# Altium schematic sheet dac.SchDoc
size A4
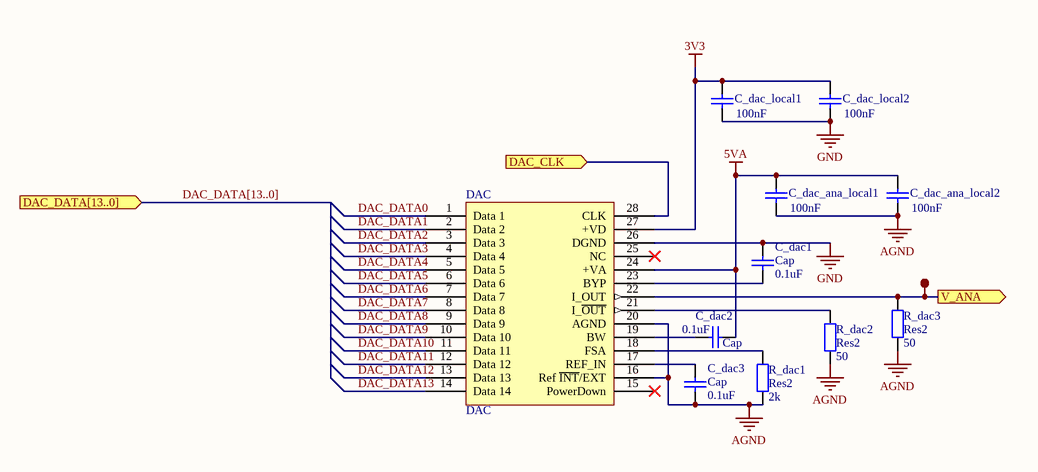
[diagram p0: dac.SchDoc]

## Parts
C_dac1  Cap  value 0.1uF  [0805]
C_dac2  Cap  value 0.1uF  [0805]
C_dac3  Cap  value 0.1uF  [0805]
C_dac_ana_local1  value 100nF  [0805]  (hidden comment: Cap Semi)
C_dac_ana_local2  value 100nF  [0805]  (hidden comment: Cap Semi)
C_dac_local1  value 100nF  [0805]  (hidden comment: Cap Semi)
C_dac_local2  value 100nF  [0805]  (hidden comment: Cap Semi)
DAC  DAC  [SOIC28]
R_dac1  Res2  value 2k  [0805]
R_dac2  Res2  value 50  [0805]
R_dac3  Res2  value 50  [0805]
TP_vout  TestPoint  [testpoint]  (value not drawn)

## Ports
DAC_CLK (in), DAC_DATA[13..0] (in), V_ANA (out)

## Nets
3V3: C_dac_local1.2 C_dac_local2.2 DAC.27(+VD)
5VA: C_dac2.1 C_dac_ana_local1.2 C_dac_ana_local2.2 DAC.24(+VA)
AGND: C_dac3.2 C_dac_ana_local1.1 C_dac_ana_local2.1 DAC.16(Ref_~{INT}/EXT) DAC.20(AGND) R_dac1.1 R_dac2.1 R_dac3.1
GND: C_dac1.1 C_dac_local1.1 C_dac_local2.1 DAC.26(DGND)
DAC_CLK: DAC.28(CLK) ; port DAC_CLK
DAC_DATA0: DAC.1(Data_1)
DAC_DATA1: DAC.2(Data_2)
DAC_DATA2: DAC.3(Data_3)
DAC_DATA3: DAC.4(Data_4)
DAC_DATA4: DAC.5(Data_5)
DAC_DATA5: DAC.6(Data_6)
DAC_DATA6: DAC.7(Data_7)
DAC_DATA7: DAC.8(Data_8)
DAC_DATA8: DAC.9(Data_9)
DAC_DATA9: DAC.10(Data_10)
DAC_DATA10: DAC.11(Data_11)
DAC_DATA11: DAC.12(Data_12)
DAC_DATA12: DAC.13(Data_13)
DAC_DATA13: DAC.14(Data_14)
V_ANA: DAC.22(I_OUT) R_dac3.2 TP_vout.1(TP) ; port V_ANA
NetC_dac1_2: C_dac1.2 DAC.23(BYP)
NetC_dac2_2: C_dac2.2 DAC.19(BW)
NetC_dac3_1: C_dac3.1 DAC.17(REF_IN)
NetDAC_18: DAC.18(FSA) R_dac1.2
NetDAC_21: DAC.21(I_~{OUT}) R_dac2.2

Not connected (* = marked no-connect by the designer): DAC 15(PowerDown)* 25(NC)*

## Buses and harness runs
bus DAC_DATA[13..0] = port DAC_DATA[13..0]

## Library data of the parts
C_dac1-C_dac3 = Cap: Capacitor; Published: 8-Jun-2000; LatestRevisionDate: 17-Jul-2002; LatestRevisionNote: Re-released for DXP Platform.; PackageReference: RAD-0.3; Publisher: Altium Limited
C_dac_ana_local1 C_dac_ana_local2 C_dac_local1 C_dac_local2 = Cap Semi: Capacitor (Semiconductor SIM Model); Published: 8-Jun-2000; LatestRevisionDate: 29-May-2009; LatestRevisionNote: IPC-7351 Footprint Added.; PackageReference: C1206; Publisher: Altium Limited; PackageDescription: Chip Capacitor
R_dac1-R_dac3 = Res2: Resistor; Published: 8-Jun-2000; LatestRevisionDate: 17-Jul-2002; LatestRevisionNote: Re-released for DXP Platform.; PackageReference: AXIAL-0.4; Publisher: Altium Limited